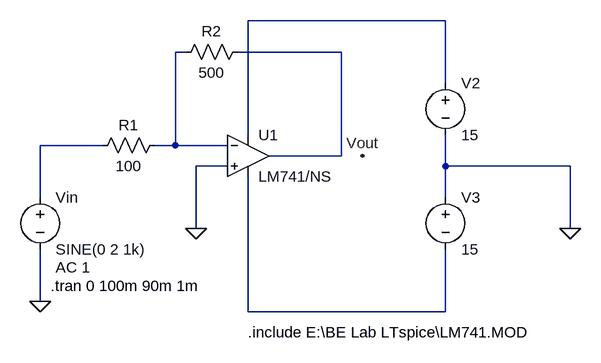
[diagram p0: schematic Exp 7 (Inverting).asc]
Exp 7 (Inverting).asc, the LTspice schematic file:
Version 4
SHEET 1 880 680
WIRE 400 -48 96 -48
WIRE 0 0 -16 0
WIRE 240 0 80 0
WIRE 400 48 400 -48
WIRE 96 128 96 -48
WIRE -128 144 -224 144
WIRE -16 144 -16 0
WIRE -16 144 -48 144
WIRE 64 144 -16 144
WIRE 240 160 240 0
WIRE 240 160 128 160
WIRE 64 176 16 176
WIRE 400 176 400 128
WIRE 592 176 400 176
WIRE -224 224 -224 144
WIRE 400 224 400 176
WIRE 16 272 16 176
WIRE 592 272 592 176
WIRE -224 384 -224 304
WIRE 96 400 96 192
WIRE 400 400 400 304
WIRE 400 400 96 400
FLAG 592 272 0
FLAG 16 272 0
FLAG -224 384 0
FLAG 272 160 Vout
SYMBOL OpAmps\\opamp2 96 96 R0
SYMATTR InstName U1
SYMATTR Value LM741/NS
SYMBOL voltage 400 32 R0
WINDOW 123 0 0 Left 0
WINDOW 39 0 0 Left 0
SYMATTR InstName V2
SYMATTR Value 15
SYMBOL voltage 400 208 R0
SYMATTR InstName V3
SYMATTR Value 15
SYMBOL voltage -224 208 R0
WINDOW 123 24 124 Left 2
WINDOW 39 0 0 Left 0
SYMATTR Value2 AC 1
SYMATTR InstName Vin
SYMATTR Value SINE(0 2 1k)
SYMBOL res -32 128 R90
WINDOW 0 0 56 VBottom 2
WINDOW 3 32 56 VTop 2
SYMATTR InstName R1
SYMATTR Value 100
SYMBOL res 96 -16 R90
WINDOW 0 0 56 VBottom 2
WINDOW 3 32 56 VTop 2
SYMATTR InstName R2
SYMATTR Value 500
TEXT -208 360 Left 2 !.tran 0 100m 90m 1m
TEXT 96 432 Left 2 !.include E:\\BE Lab LTspice\\LM741.MOD

The netlist it stands for:
* Exp 7 (Inverting).asc
XU1 0 N002 N001 N005 N003 LM741/NS  ; pins In+ In- V+ V- OUT
V2 N001 0 15
V3 0 N005 15
Vin N004 0 SINE(0 2 1k) AC 1
R1 N002 N004 100
R2 N003 N002 500
.tran 0 100m 90m 1m
.include E:\BE Lab LTspice\LM741.MOD
.backanno
.end